# Altium schematic sheet DECAWAVE.SchDoc
size A4
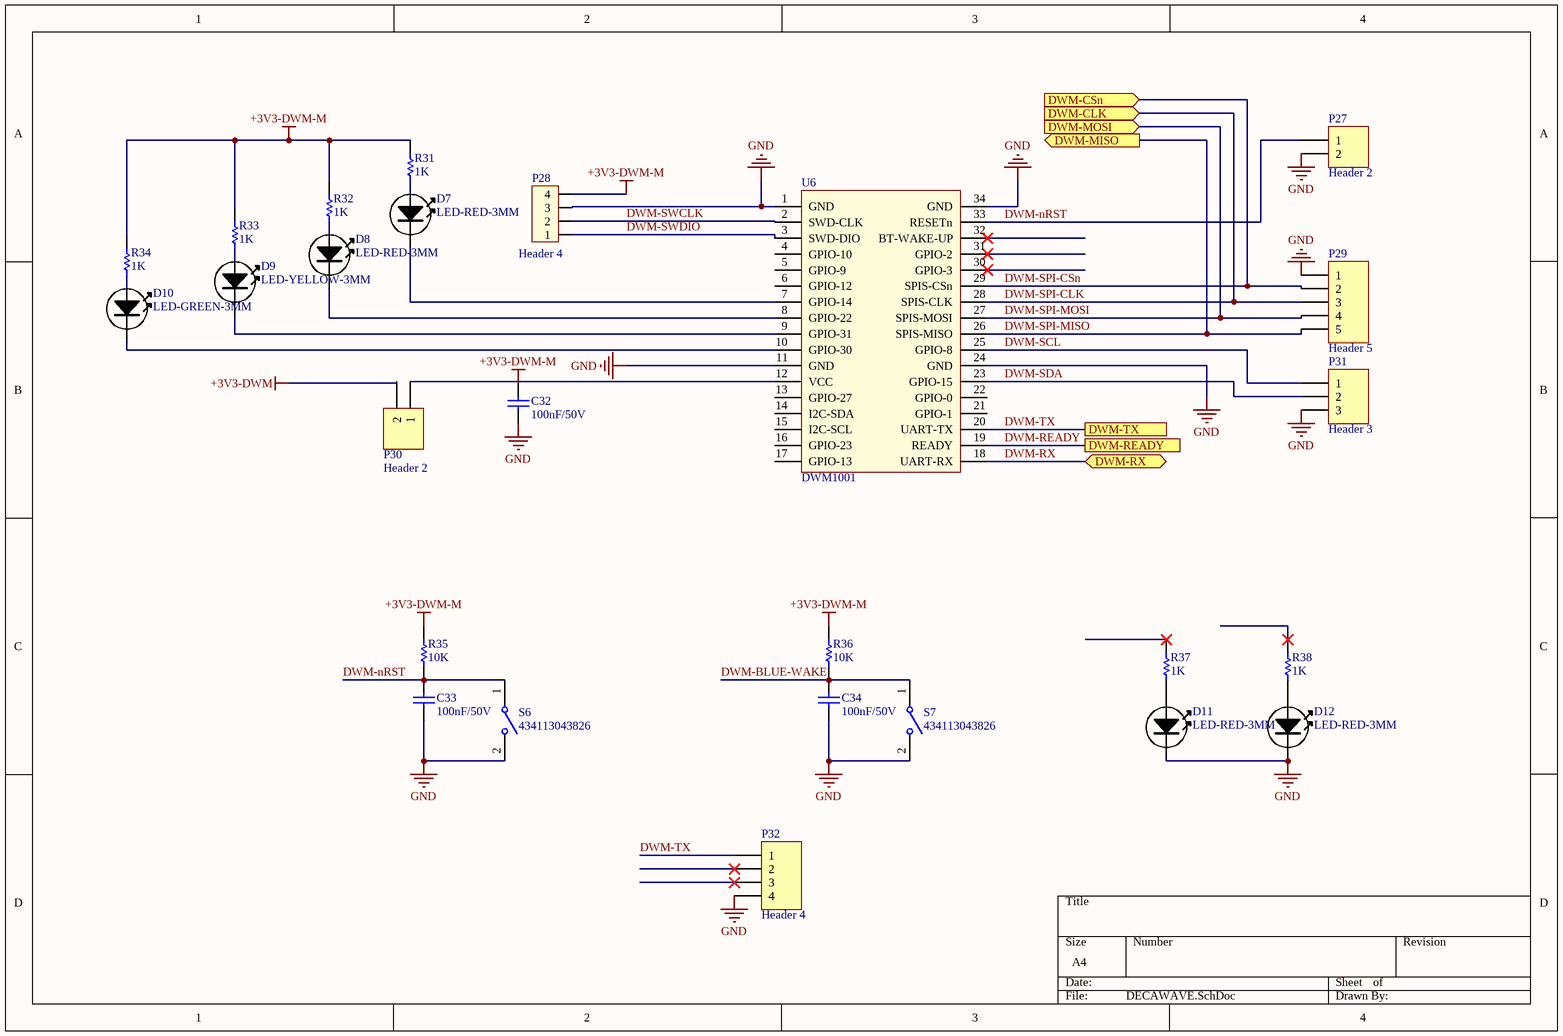
[diagram p0: DECAWAVE.SchDoc]

## Parts
C32  value 100nF/50V  [CAP-SM-0805]  (hidden comment: Cap-100nF-50V-0805)
C33  value 100nF/50V  [CAP-SM-0805]  (hidden comment: Cap-100nF-50V-0805)
C34  value 100nF/50V  [CAP-SM-0805]  (hidden comment: Cap-100nF-50V-0805)
D7  LED-RED-3MM  [LED-3MM-RED]
D8  LED-RED-3MM  [LED-3MM-RED]
D9  LED-YELLOW-3MM  [LED-3MM-YELLOW]
D10  LED-GREEN-3MM  [LED-3MM-GREEN]
D11  LED-RED-3MM  [LED-3MM-RED]
D12  LED-RED-3MM  [LED-3MM-RED]
P27  Header 2  [HDR1X2]
P28  Header 4  [HED4]
P29  Header 5  [HDR1X5]
P30  Header 2  [HDR1X2]
P31  Header 3  [HDR1X3]
P32  Header 4  [HDR1X4]
R31  value 1K  [RES-SM-0805]  (hidden comment: Res-1K-0805)
R32  value 1K  [RES-SM-0805]  (hidden comment: Res-1K-0805)
R33  value 1K  [RES-SM-0805]  (hidden comment: Res-1K-0805)
R34  value 1K  [RES-SM-0805]  (hidden comment: Res-1K-0805)
R35  value 10K  [RES-SM-0805]  (hidden comment: Res-10k-0805)
R36  value 10K  [RES-SM-0805]  (hidden comment: Res-10k-0805)
R37  value 1K  [RES-SM-0805]  (hidden comment: Res-1K-0805)
R38  value 1K  [RES-SM-0805]  (hidden comment: Res-1K-0805)
S6  434113043826  [434113043826]
S7  434113043826  [434113043826]
U6  DWM1001

## Ports
DWM-CLK (in), DWM-CSn (in), DWM-MISO (out), DWM-MOSI (in), DWM-READY, DWM-RX (bidir), DWM-TX

## Nets
+3V3-DWM: P30.2
+3V3-DWM-M: C32.2 P28.4 R31.2 R32.2 R33.2 R34.2 R35.2 R36.2
GND: C32.1 C33.1 C34.1 D11.K D12.K P27.2 P28.3 P29.1 P31.3 P32.4 S6.2 S7.2 U6.1(GND) U6.11(GND) U6.24(GND) U6.34(GND)
\: P32.1 U6.20(UART-TX) ; port DWM-TX  [also labelled DWM-TX]
DWM-BLUE-WAKE: C34.2 R36.1 S7.1
DWM-nRST: C33.2 P27.1 R35.1 S6.1 U6.33(RESETn)
DWM-READY: U6.19(READY) ; port DWM-READY
DWM-RX: U6.18(UART-RX) ; port DWM-RX
DWM-SCL: P31.1 U6.25(GPIO-8)
DWM-SDA: P31.2 U6.23(GPIO-15)
DWM-SPI-CLK: P29.3 U6.28(SPIS-CLK) ; port DWM-CLK
DWM-SPI-CSn: P29.2 U6.29(SPIS-CSn) ; port DWM-CSn
DWM-SPI-MISO: P29.5 U6.26(SPIS-MISO) ; port DWM-MISO
DWM-SPI-MOSI: P29.4 U6.27(SPIS-MOSI) ; port DWM-MOSI
DWM-SWCLK: P28.2 U6.2(SWD-CLK)
DWM-SWDIO: P28.1 U6.3(SWD-DIO)
NetD7_A: D7.A R31.1
NetD7_K: D7.K U6.7(GPIO-14)
NetD8_A: D8.A R32.1
NetD8_K: D8.K U6.8(GPIO-22)
NetD9_A: D9.A R33.1
NetD9_K: D9.K U6.9(GPIO-31)
NetD10_A: D10.A R34.1
NetD10_K: D10.K U6.10(GPIO-30)
NetD11_A: D11.A R37.1
NetD12_A: D12.A R38.1
NetP30_1: P30.1 U6.12(VCC)

Not connected (* = marked no-connect by the designer): P32 2* 3*; R37 2*; R38 2*; U6 4(GPIO-10) 5(GPIO-9) 6(GPIO-12) 13(GPIO-27) 14(I2C-SDA) 15(I2C-SCL) 16(GPIO-23) 17(GPIO-13) 21(GPIO-1) 22(GPIO-0) 30(GPIO-3)* 31(GPIO-2)* 32(BT-WAKE-UP)*

## Library data of the parts
C32-C34 = Cap-100nF-50V-0805: CAP CER 0.1UF 50V Y5V 0805; Manufacturer: Samsung Electro-Mechanics; Manufacturer Part Number: CL21F104ZBCNNNC; Local Supplier: thegioiic; Local Supplier Link: https://thegioiic.com/products/tu-100nf-0-1uf-50v-0805; Supplier 1: Digikey; Supplier 1 Part Number: 1276-1007-1-ND; Supplier 1 Link: https://www.digikey.com/product-detail/en/samsung-electro-mechanics/CL21F104ZBCNNNC/1276-1007-1-ND/3889093
P27 P30 = Header 2: Header, 2-Pin; LatestRevisionDate: 17-Jul-2002; LatestRevisionNote: Re-released for DXP Platform.; Publisher: Altium Limited
P28 = Hed4: Header 4 (Green); Value: Header 4
P29 = Header 5: Header, 5-Pin; LatestRevisionDate: 17-Jul-2002; LatestRevisionNote: Re-released for DXP Platform.; Publisher: Altium Limited
P31 = Header 3: Header, 3-Pin; LatestRevisionDate: 17-Jul-2002; LatestRevisionNote: Re-released for DXP Platform.; Publisher: Altium Limited
P32 = Header 4: Header, 4-Pin; LatestRevisionDate: 17-Jul-2002; LatestRevisionNote: Re-released for DXP Platform.; Publisher: Altium Limited
R31-R34 R37 R38 = Res-1K-0805: RES 1K OHM 1% 1/4W 0805; Manufacturer: Stackpole Electronics Inc; Manufacturer Part Number: RNCP0805FTD1K00; Local Supplier: thegioiic; Local Supplier Link: https://thegioiic.com/products/dien-tro-1k-ohm-0805-5; Supplier 1: Digikey; Supplier 1 Link: https://www.digikey.com/product-detail/en/stackpole-electronics-inc/RNCP0805FTD1K00/RNCP0805FTD1K00CT-ND/2240568; Supplier 1 Part Number: RNCP0805FTD1K00CT-ND
R35 R36 = Res-10k-0805: RES 10K OHM 1% 1/4W 0805; Manufacturer: Stackpole Electronics Inc; Manufacturer Part Number: RNCP0805FTD10K0; Local Supplier: thegioiic; Local Supplier Link: https://thegioiic.com/products/dien-tro-10k-ohm-0805-5; Supplier 1: Digikey; Supplier 1 Link: https://www.digikey.com/product-detail/en/stackpole-electronics-inc/RNCP0805FTD10K0/RNCP0805FTD10K0CT-ND/2240601; Supplier 1 Part Number: RNCP0805FTD10K0CT-ND
S6 S7 = 434113043826: WS-TASV J-Bend SMT Tact Switch 6x3.5mm, height 4.3mm, 260gf; Rated Voltage: 12VDC; Rated Current: 50mA; Washable: No; ComponentLink1Description: Manufacturer; ComponentLink1URL: http://www.we-online.de; ComponentLink2Description: Datasheet; ComponentLink2URL: https://katalog.we-online.com/em/datasheet/434113043826.pdf; Operating Temperature: -40 to +85degC; Part Number: 434113043826; Published Date: September 2019; Contact Material: Stainless Steel; Height: 4.3mm; Mounting Technology: SMT; Contact Plating: Silver; Operation Force: 260gf; Packaging: Tape and Reel; Terminal Material: Copper Alloy; Publisher: Wurth Elektronik; Terminal Plating: Silver